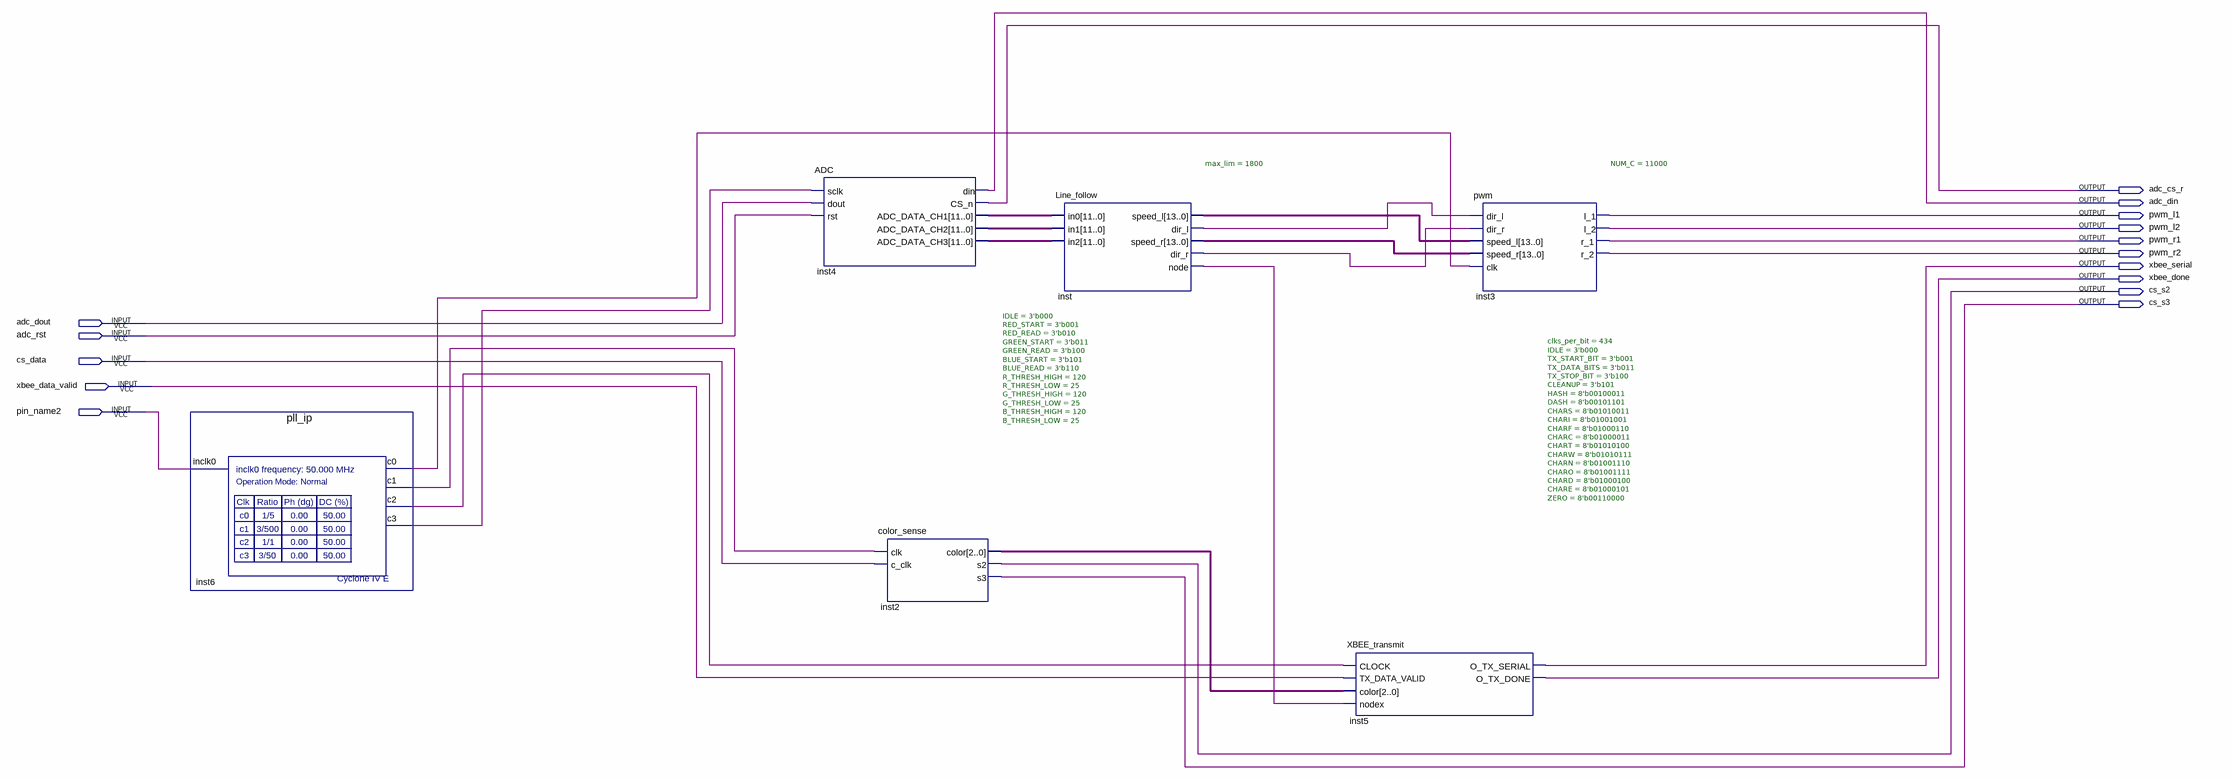
[diagram p0: schematic sheet]
// Quartus schematic SM_bot.bdf as structural Verilog: 6 symbols, 15 pins
module SM_bot (
  input  adc_dout,
  input  adc_rst,
  input  cs_data,
  input  xbee_data_valid,
  input  pin_name2,
  output adc_cs_r,
  output adc_din,
  output pwm_l1,
  output pwm_l2,
  output pwm_r1,
  output pwm_r2,
  output xbee_serial,
  output xbee_done,
  output cs_s2,
  output cs_s3
);

  wire inst6_c0, inst6_c1, inst6_c2, inst6_c3, inst_dir_l, inst_dir_r, inst_node;
  wire [2:0] inst2_color;
  wire [11:0] inst4_adc_data_ch1, inst4_adc_data_ch2, inst4_adc_data_ch3;
  wire [13:0] inst_speed_l, inst_speed_r;

  pll_ip inst6 (.inclk0(pin_name2), .c0(inst6_c0), .c1(inst6_c1), .c2(inst6_c2), .c3(inst6_c3));
  ADC inst4 (
    .sclk(inst6_c3), .dout(adc_dout), .rst(adc_rst), .din(adc_din), .CS_n(adc_cs_r),
    .ADC_DATA_CH1(inst4_adc_data_ch1), .ADC_DATA_CH2(inst4_adc_data_ch2), .ADC_DATA_CH3(inst4_adc_data_ch3));
  color_sense #(.IDLE(3'b000), .RED_START(3'b001), .RED_READ(3'b010), .GREEN_START(3'b011), .GREEN_READ(3'b100), .BLUE_START(3'b101), .BLUE_READ(3'b110), .R_THRESH_HIGH(120), .R_THRESH_LOW(25), .G_THRESH_HIGH(120), .G_THRESH_LOW(25), .B_THRESH_HIGH(120), .B_THRESH_LOW(25)) inst2 (
    .clk(inst6_c1), .c_clk(cs_data), .color(inst2_color), .s2(cs_s2), .s3(cs_s3));
  Line_follow #(.max_lim(1800)) inst (
    .in0(inst4_adc_data_ch1), .in1(inst4_adc_data_ch2), .in2(inst4_adc_data_ch3), .speed_l(inst_speed_l),
    .dir_l(inst_dir_l), .speed_r(inst_speed_r), .dir_r(inst_dir_r), .node(inst_node));
  XBEE_transmit #(.clks_per_bit(434), .IDLE(3'b000), .TX_START_BIT(3'b001), .TX_DATA_BITS(3'b011), .TX_STOP_BIT(3'b100), .CLEANUP(3'b101), .HASH(8'b00100011), .DASH(8'b00101101), .CHARS(8'b01010011), .CHARI(8'b01001001), .CHARF(8'b01000110), .CHARC(8'b01000011), .CHART(8'b01010100), .CHARW(8'b01010111), .CHARN(8'b01001110), .CHARO(8'b01001111), .CHARD(8'b01000100), .CHARE(8'b01000101), .ZERO(8'b00110000)) inst5 (
    .CLOCK(inst6_c2), .TX_DATA_VALID(xbee_data_valid), .color(inst2_color), .nodex(inst_node),
    .O_TX_SERIAL(xbee_serial), .O_TX_DONE(xbee_done));
  pwm #(.NUM_C(11000)) inst3 (
    .dir_l(inst_dir_l), .dir_r(inst_dir_r), .speed_l(inst_speed_l), .speed_r(inst_speed_r), .clk(inst6_c0),
    .l_1(pwm_l1), .l_2(pwm_l2), .r_1(pwm_r1), .r_2(pwm_r2));
endmodule
